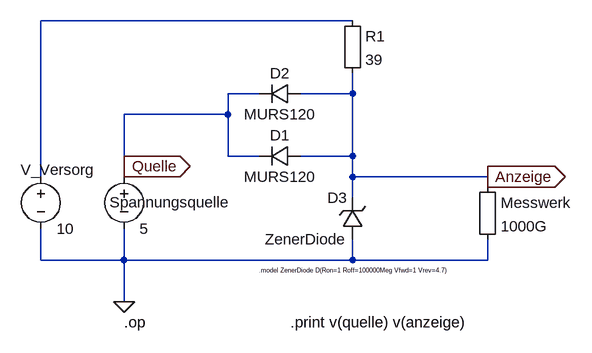
[diagram p0: schematic V2 UND.asc]
V2 UND.asc, the LTspice schematic file:
Version 4
SHEET 1 920 680
WIRE 192 -64 -288 -64
WIRE 48 48 0 48
WIRE 192 48 192 16
WIRE 192 48 112 48
WIRE 0 80 0 48
WIRE 0 80 -160 80
WIRE 0 144 0 80
WIRE 48 144 0 144
WIRE 192 144 192 48
WIRE 192 144 112 144
WIRE -160 160 -160 80
WIRE -288 176 -288 -64
WIRE -160 176 -160 160
WIRE 192 176 192 144
WIRE 400 176 192 176
WIRE 400 192 400 176
WIRE 192 208 192 176
WIRE -288 304 -288 256
WIRE -160 304 -160 256
WIRE -160 304 -288 304
WIRE 192 304 192 272
WIRE 192 304 -160 304
WIRE 400 304 400 272
WIRE 400 304 192 304
WIRE -160 368 -160 304
FLAG -160 368 0
FLAG -160 160 Quelle
IOPIN -160 160 Out
FLAG 400 176 Anzeige
IOPIN 400 176 Out
SYMBOL voltage -160 160 R0
WINDOW 0 -22 55 Left 2
SYMATTR InstName Spannungsquelle
SYMATTR Value 5
SYMBOL Misc\\EuropeanResistor 384 176 R0
SYMATTR InstName Messwerk
SYMATTR Value 1000G
SYMBOL Misc\\EuropeanResistor 176 -80 R0
SYMATTR InstName R1
SYMATTR Value 39
SYMBOL diode 112 128 R90
WINDOW 0 0 32 VBottom 2
WINDOW 3 32 32 VTop 2
SYMATTR InstName D1
SYMATTR Value MURS120
SYMBOL diode 112 32 R90
WINDOW 0 0 32 VBottom 2
WINDOW 3 32 32 VTop 2
SYMATTR InstName D2
SYMATTR Value MURS120
SYMBOL zener 208 272 R180
WINDOW 0 24 64 Left 2
WINDOW 3 24 0 Left 2
SYMATTR InstName D3
SYMATTR Value ZenerDiode
SYMATTR Description Diode
SYMATTR Type diode
SYMBOL voltage -288 160 R0
WINDOW 0 -31 5 Left 2
SYMATTR InstName V_Versorg
SYMATTR Value 10
TEXT -160 400 Left 2 !.op
TEXT 96 400 Left 2 !.print v(quelle) v(anzeige)
TEXT 48 320 Left 0 !.model ZenerDiode D(Ron=1 Roff=100000Meg Vfwd=1 Vrev=4.7)

The netlist it stands for:
* V2 UND.asc
V§Spannungsquelle Quelle 0 5
R§Messwerk Anzeige 0 1000G
R1 N001 Anzeige 39
D1 Anzeige Quelle MURS120
D2 Anzeige Quelle MURS120
D3 0 Anzeige ZenerDiode
V_Versorg N001 0 10
.model D D
.lib standard.dio
.op
.print v(quelle) v(anzeige)
.model ZenerDiode D(Ron=1 Roff=100000Meg Vfwd=1 Vrev=4.7)
.backanno
.end